# EAGLE design LightStickPower (EAGLE 7.6.0)
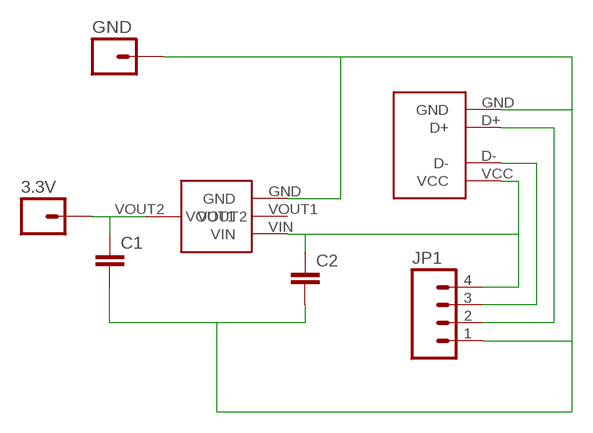
[diagram p0: schematic, sheet 1]

## Parts
3.3V  M01PTH  [1X01]
C1  CAP0805  [0805]
C2  CAP0805  [0805]
GND  M01PTH  [1X01]
JP1  M04PTH  [1X04]
USB1  USB_A_932  [USB_A_932]
V1  VOLTAGE_REGULATOR_AP2114H  [SOT-223]

## Nets
N$1: C2.1 JP1.4 USB1.VCC V1.VIN
N$2: JP1.3 USB1.D-
N$3: JP1.2 USB1.D+
N$5: C1.2 C2.2 GND.1 JP1.1 USB1.GND V1.GND
N$7: 3.3V.1 C1.1 V1.VOUT2
Unconnected: V1.VOUT1

## Library data of the parts
3.3V GND = SparkFun-Connectors:M01: Header 1 Standard 1-pin 0.1" header. Use with straight break away headers (SKU : PRT-00116), right angle break away headers (PRT-00553), swiss pins (PRT-00743), machine pins (PRT-00117), and female headers (PRT-00115).
C1 C2 = SparkFun-Capacitors:CAP: Capacitor Standard 0603 ceramic capacitor, and 0.1" leaded capacitor.
JP1 = SparkFun-Connectors:M04: Header 4 Standard 4-pin 0.1" header. Use with straight break away headers (SKU : PRT-00116), right angle break away headers (PRT-00553), swiss pins (PRT-00743), machine pins (PRT-00117), and female headers (PRT-00115). Molex polarized connector foot print use with SKU : PRT-08231 with associated crimp pins and housings. 1MM SMD Version SKU: PRT-10208
USB1 = freddyLibr:USB_A_932: USB A Plug. Through hole.
V1 = freddyLibr:VOLTAGE_REGULATOR_AP2114H

## Board
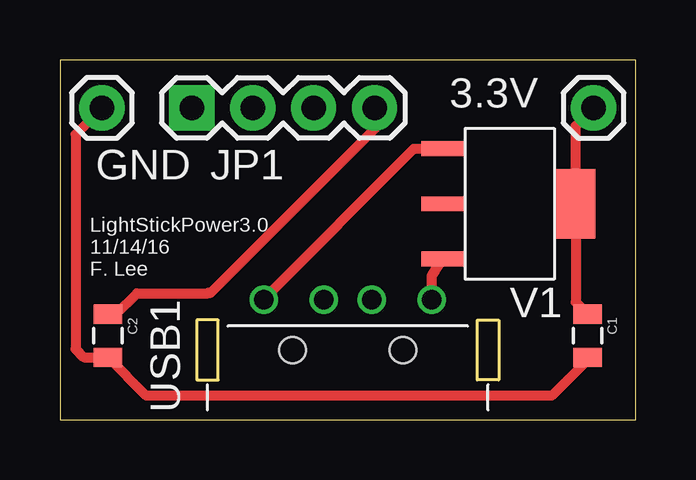
[diagram p1: board, top side]
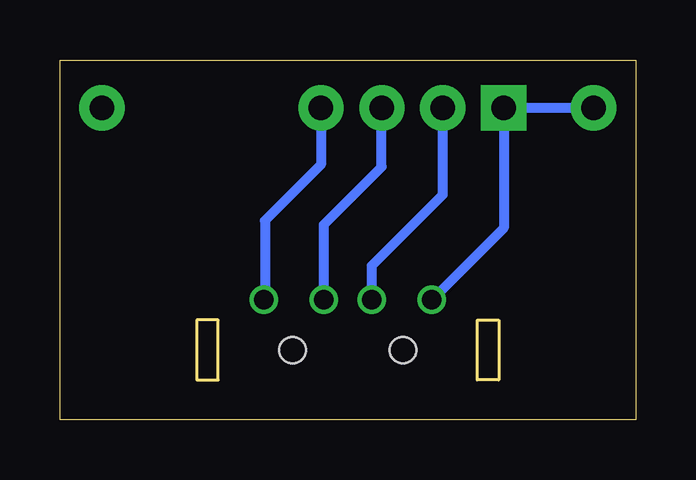
[diagram p2: board, bottom side, seen from below]

Size 24 x 15 mm. Coordinates in mm from the lower left corner, seen from the top.
Outline: 0,0 24,0 24,15 0,15 0,0
Copper layers (1*16): Top 0.0356mm / dielectric 1.5011mm / Bottom 0.0356mm
Design rules "LaenPCBOrder": minimum track width 6mil, minimum drill 13mil, track to track 6mil, track to pad 6mil, pad to pad 6mil, via to via 6mil, smd to smd 6mil, copper to edge 15mil, drill to drill 6mil, minimum pad ring 7mil, minimum via ring 7mil, stop-mask expansion 3mil, vias tented up to drill 0mil, thermal gap 10mil

### Footprints (pad centres in the part's own frame; a part is rotated, then mirrored left to right if it is on the bottom)
1X01 = drill 1.016 pad 1.88: 1 0,0
0805 = smd 0.8 x 1.2: 1 -0.9,0; 2 0.9,0
1X04 = drill 1.016 pad 1.88 square: 1 0,0 | drill 1.016 pad 1.88: 2 2.54,0; 3 5.08,0; 4 7.62,0
USB_A_932 = drill 0.8: D+ 1,-2.1; D- -1,-2.1; GND 3.5,-2.1; VCC -3.5,-2.1 | hole 1.1: -2.3,0; 2.3,0
SOT-223 = smd 0.61 x 1.75: GND -2.3,-2.8; VIN 2.3,-2.8; VOUT1 0,-2.8 | smd 2.9 x 1.65: VOUT2 0,2.75

### Placement (x,y rotation side)
3.3V  22.25,13 0 top
C1  22,3.5 270 top
C2  2,3.5 270 top
GND  1.75,13 0 top
JP1  5.5,13 0 top
USB1  12,2.9 180 top
V1  18.75,9 270 top

### Tracks (layer width: path | path; a pad name or v marks a point on that pad's centre or on a via)
N$1
  Top 0.406: USB1.VCC 15.5,6 V1.VIN | C2.1 2.34,4.4 3.21,5.27 6.17,5.27 6.19,5.29 6.29,5.29 13.12,12.12 JP1.4
  Bottom 0.406: JP1.4 13.12,10.63 15.45,8.3 15.45,5.05 USB1.VCC
N$2
  Bottom 0.406: USB1.D- 13,8.13 10.59,10.54 JP1.3
N$3
  Bottom 0.406: USB1.D+ 11,6.42 8.04,9.38 JP1.2
N$5
  Top 0.406: C1.2 22,2.5 20.5,1 3.6,1 C2.2 0.99,2.6 0.65,2.94 0.65,11.89 GND.1 | USB1.GND 8.5,5.04 14.76,11.3 V1.GND
  Bottom 0.406: USB1.GND 5.5,8 JP1.1 GND.1
N$7
  Top 0.406: 3.3V.1 21.5,12.25 V1.VOUT2 21.5,4.9 C1.1

### Text on the board
tNames: LightStickPower3.0 / 11/14/16 / F. Lee